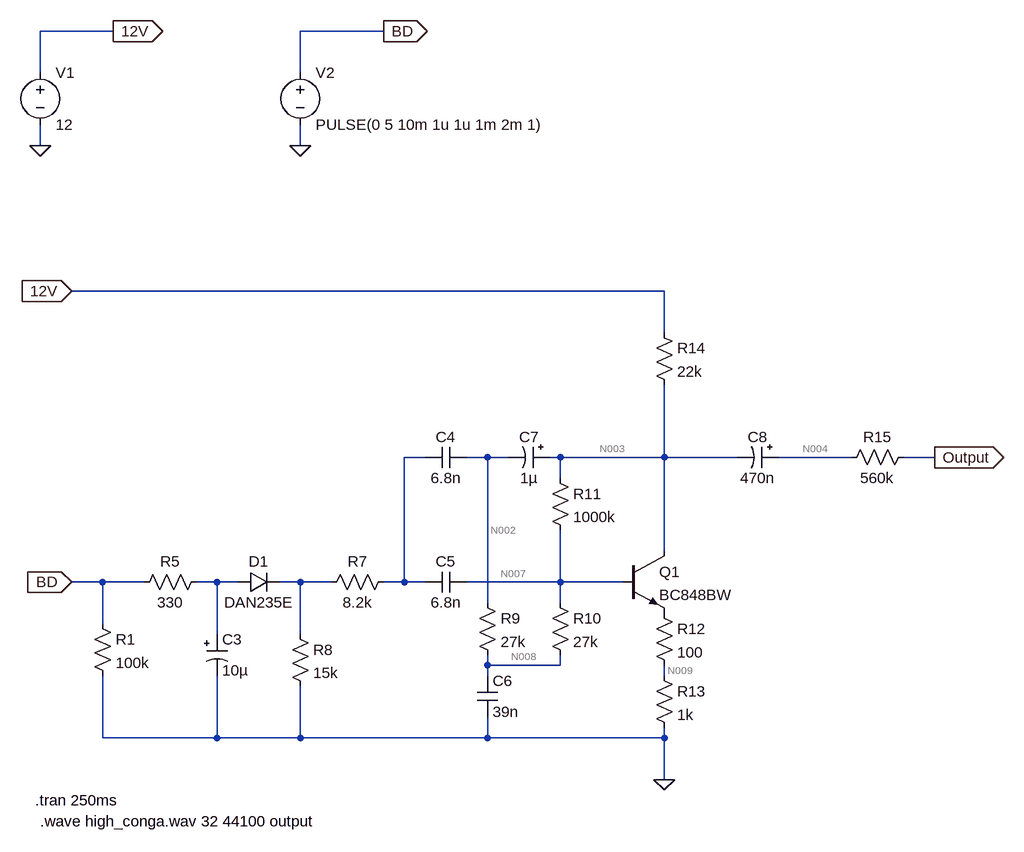
[diagram p0: schematic high_conga.asc]
high_conga.asc, the LTspice schematic file:
Version 4
SHEET 1 2460 680
WIRE 752 -880 640 -880
WIRE 1168 -880 1040 -880
WIRE 640 -816 640 -880
WIRE 1040 -816 1040 -880
WIRE 640 -704 640 -736
WIRE 1040 -704 1040 -736
WIRE 1600 -480 688 -480
WIRE 1600 -416 1600 -480
WIRE 1232 -224 1200 -224
WIRE 1328 -224 1296 -224
WIRE 1360 -224 1328 -224
WIRE 1440 -224 1424 -224
WIRE 1600 -224 1600 -336
WIRE 1600 -224 1440 -224
WIRE 1712 -224 1600 -224
WIRE 1888 -224 1776 -224
WIRE 2016 -224 1968 -224
WIRE 1440 -192 1440 -224
WIRE 1600 -80 1600 -224
WIRE 736 -32 688 -32
WIRE 800 -32 736 -32
WIRE 912 -32 880 -32
WIRE 944 -32 912 -32
WIRE 1040 -32 1008 -32
WIRE 1088 -32 1040 -32
WIRE 1200 -32 1200 -224
WIRE 1200 -32 1168 -32
WIRE 1232 -32 1200 -32
WIRE 1440 -32 1440 -112
WIRE 1440 -32 1296 -32
WIRE 1536 -32 1440 -32
WIRE 1328 0 1328 -224
WIRE 1440 0 1440 -32
WIRE 736 32 736 -32
WIRE 912 48 912 -32
WIRE 1040 48 1040 -32
WIRE 1328 96 1328 80
WIRE 1440 96 1440 80
WIRE 1440 96 1328 96
WIRE 1328 112 1328 96
WIRE 1600 112 1600 96
WIRE 736 208 736 112
WIRE 912 208 912 112
WIRE 912 208 736 208
WIRE 1040 208 1040 128
WIRE 1040 208 912 208
WIRE 1328 208 1328 176
WIRE 1328 208 1040 208
WIRE 1600 208 1600 192
WIRE 1600 208 1328 208
WIRE 1600 272 1600 208
FLAG 752 -880 12V
IOPIN 752 -880 Out
FLAG 640 -704 0
FLAG 1168 -880 BD
IOPIN 1168 -880 Out
FLAG 1040 -704 0
FLAG 1600 272 0
FLAG 2016 -224 Output
IOPIN 2016 -224 Out
FLAG 688 -480 12V
IOPIN 688 -480 In
FLAG 688 -32 BD
IOPIN 688 -32 In
SYMBOL res 1184 -48 R90
WINDOW 0 0 56 VBottom 2
WINDOW 3 32 56 VTop 2
SYMATTR InstName R7
SYMATTR Value 8.2k
SYMBOL cap 1296 -48 R90
WINDOW 0 0 32 VBottom 2
WINDOW 3 32 32 VTop 2
SYMATTR InstName C5
SYMATTR Value 6.8n
SYMBOL res 1024 32 R0
SYMATTR InstName R8
SYMATTR Value 15k
SYMBOL res 1312 -16 R0
SYMATTR InstName R9
SYMATTR Value 27k
SYMBOL cap 1312 112 R0
SYMATTR InstName C6
SYMATTR Value 39n
SYMBOL res 1424 -16 R0
SYMATTR InstName R10
SYMATTR Value 27k
SYMBOL res 1424 -208 R0
SYMATTR InstName R11
SYMATTR Value 1000k
SYMBOL res 1584 0 R0
SYMATTR InstName R12
SYMATTR Value 100
SYMBOL res 1584 96 R0
SYMATTR InstName R13
SYMATTR Value 1k
SYMBOL res 1984 -240 R90
WINDOW 0 0 56 VBottom 2
WINDOW 3 32 56 VTop 2
SYMATTR InstName R15
SYMATTR Value 560k
SYMBOL voltage 640 -832 R0
WINDOW 123 0 0 Left 0
WINDOW 39 0 0 Left 0
SYMATTR InstName V1
SYMATTR Value 12
SYMBOL res 896 -48 R90
WINDOW 0 0 56 VBottom 2
WINDOW 3 32 56 VTop 2
SYMATTR InstName R5
SYMATTR Value 330
SYMBOL polcap 896 48 R0
SYMATTR InstName C3
SYMATTR Value 10µ
SYMATTR SpiceLine V=10
SYMBOL diode 944 -16 R270
WINDOW 0 32 32 VTop 2
WINDOW 3 0 32 VBottom 2
SYMATTR InstName D1
SYMATTR Value DAN235E
SYMBOL cap 1296 -240 R90
WINDOW 0 0 32 VBottom 2
WINDOW 3 32 32 VTop 2
SYMATTR InstName C4
SYMATTR Value 6.8n
SYMBOL polcap 1424 -240 R90
WINDOW 0 0 32 VBottom 2
WINDOW 3 32 32 VTop 2
SYMATTR InstName C7
SYMATTR Value 1µ
SYMATTR SpiceLine V=25
SYMBOL polcap 1776 -240 R90
WINDOW 0 0 32 VBottom 2
WINDOW 3 32 32 VTop 2
SYMATTR InstName C8
SYMATTR Value 470n
SYMATTR SpiceLine V=25
SYMBOL npn 1536 -80 R0
SYMATTR InstName Q1
SYMATTR Value BC848BW
SYMBOL res 1584 -432 R0
SYMATTR InstName R14
SYMATTR Value 22k
SYMBOL voltage 1040 -832 R0
WINDOW 123 0 0 Left 0
WINDOW 39 0 0 Left 0
SYMATTR InstName V2
SYMATTR Value PULSE(0 5 10m 1u 1u 1m 2m 1)
SYMBOL res 720 16 R0
SYMATTR InstName R1
SYMATTR Value 100k
TEXT 632 304 Left 2 !.tran 250ms
TEXT 640 336 Left 2 !.wave high_conga.wav 32 44100 output

The netlist it stands for:
* high_conga.asc
R7 N001 N006 8.2k
C5 N007 N001 6.8n
R8 N006 0 15k
R9 N002 N008 27k
C6 N008 0 39n
R10 N007 N008 27k
R11 N003 N007 1000k
R12 P001 N009 100
R13 N009 0 1k
R15 Output N004 560k
V1 12V 0 12
R5 N005 BD 330
C3 N005 0 10µ V=10
D1 N005 N006 DAN235E
C4 N002 N001 6.8n
C7 N003 N002 1µ V=25
C8 N004 N003 470n V=25
Q1 N003 N007 P001 0 BC848BW
R14 12V N003 22k
V2 BD 0 PULSE(0 5 10m 1u 1u 1m 2m 1)
R1 BD 0 100k
.model D D
.lib standard.dio
.model NPN NPN
.model PNP PNP
.lib standard.bjt
.tran 250ms
.wave high_conga.wav 32 44100 output
.backanno
.end

* Results of the author's LTspice run, read from the files saved beside the schematic
* Operating Point, zero values left out:
*   V(n007) = 1.053 V
*   V(n002) = 1.053 V
*   V(n008) = 1.053 V
*   V(n003) = 2.591 V
*   V(p001) = 470.5 mV
*   V(n009) = 427.7 mV
*   V(output) = 1.218 µV
*   V(n004) = 1.218 µV
*   V(12v) = 12 V
*   Ic(Q1) = 426.2 µA
*   Ib(Q1) = 1.538 µA
*   Ie(Q1) = -427.7 µA
*   I(R11) = 1.538 µA
*   I(R12) = 427.7 µA
*   I(R13) = 427.7 µA
*   I(R14) = 427.7 µA
*   I(V1) = -427.7 µA